# Altium schematic sheet Controlador Strobo.SchDoc
size A4
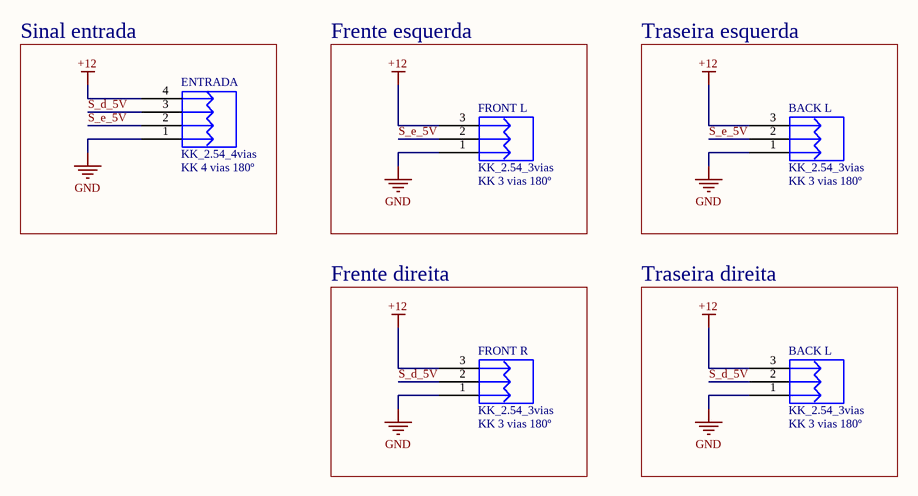
[diagram p0: Controlador Strobo.SchDoc]

## Parts
(Parts that share a designator on the sheet are numbered #1, #2 ... from top to bottom, then left to right.)
BACK_L#1  KK_2.54_3vias  Valor: KK 3 vias 180º  [KK_3vias_180º]
BACK_L#2  KK_2.54_3vias  Valor: KK 3 vias 180º  [KK_3vias_180º]
ENTRADA  KK_2.54_4vias  Valor: KK 4 vias 180º  [KK_4vias_180°]
FRONT_L  KK_2.54_3vias  Valor: KK 3 vias 180º  [KK_3vias_180º]
FRONT_R  KK_2.54_3vias  Valor: KK 3 vias 180º  [KK_3vias_180º]

## Blocks framed on the sheet
Sinal entrada: ENTRADA
Frente esquerda: FRONT_L
Traseira esquerda: BACK_L#1
Frente direita: FRONT_R
Traseira direita: BACK_L#2

## Nets
+12: BACK_L#1.3 BACK_L#2.3 ENTRADA.4 FRONT_L.3 FRONT_R.3
GND: BACK_L#1.1 BACK_L#2.1 ENTRADA.1 FRONT_L.1 FRONT_R.1
S_d_5V: BACK_L#2.2 ENTRADA.3 FRONT_R.2
S_e_5V: BACK_L#1.2 ENTRADA.2 FRONT_L.2

## Library data of the parts
BACK_L#1 BACK_L#2 FRONT_L FRONT_R = KK_2.54_3vias: Conector KK 2.54mm 3 vias; Descrição: Conector KK 3 vias com passo 2.54mm; Encapsulamento: PTH - 180º; Modelo: 3 vias - 180º; Marca: *; Observação: *
ENTRADA = KK_2.54_4vias: Conector KK 2.54mm 4 vias; Descrição: Conector KK 3 vias com passo 2.54mm; Encapsulamento: PTH - 180º; Modelo: 3 vias - 180º; Marca: *; Observação: *